# Altium schematic sheet WATCHDOG.SchDoc
size A; SheetNumber: 4; SheetTotal: 4
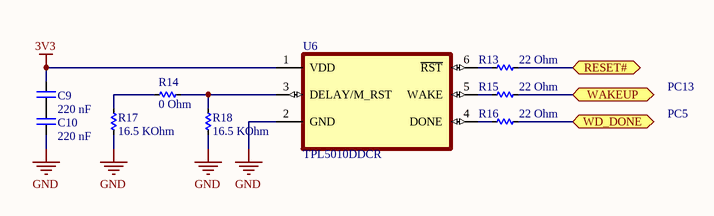
[diagram p0: WATCHDOG.SchDoc]

## Parts
C9  220 nF  [CAP_C_1608X80]
C10  220 nF  [CAP_C_1608X80]
R13  22 Ohm  [RES_C_1608X60]
R14  0 Ohm  [RES_C_1608X60]
R15  22 Ohm  [RES_C_1608X60]
R16  22 Ohm  [RES_C_1608X60]
R17  16.5 KOhm  [RES_C_1608X60]
R18  16.5 KOhm  [RES_C_1608X60]
U6  TPL5010DDCR  [TPL5010DDCR]

## Ports
RESET# (bidir), WAKEUP (bidir), WD_DONE (bidir)

## Nets
3V3: C9.2 U6.1(VDD)
GND: C10.1 R17.1 R18.1 U6.2(GND)
RESET#: R13.2 ; port RESET#
WAKEUP: R15.2 ; port WAKEUP
WD_DONE: R16.2 ; port WD_DONE
NetC9_1: C9.1 C10.2
NetR13_1: R13.1 U6.6(~{RST})
NetR14_1: R14.1 R17.2
NetR14_2: R14.2 R18.2 U6.3(DELAY/M_RST)
NetR15_1: R15.1 U6.5(WAKE)
NetR16_1: R16.1 U6.4(DONE)

## Notes on the sheet
- PC13
- PC5

## Library data of the parts
C9 C10 = CAP_SMD: CAP_Chip; Value: 33pF
R13-R18 = _RES_B_2: RES
U6 = TPL5010DDCR: OSC PROG TIMER TSOT23-6